# EasyEDA schematic pcb.json
TITLE: Sheet_1; REV: 1.0; Date: 2024-07-03; Sheet: 1/1; Drawn By: vaanika06; Company: Your Company
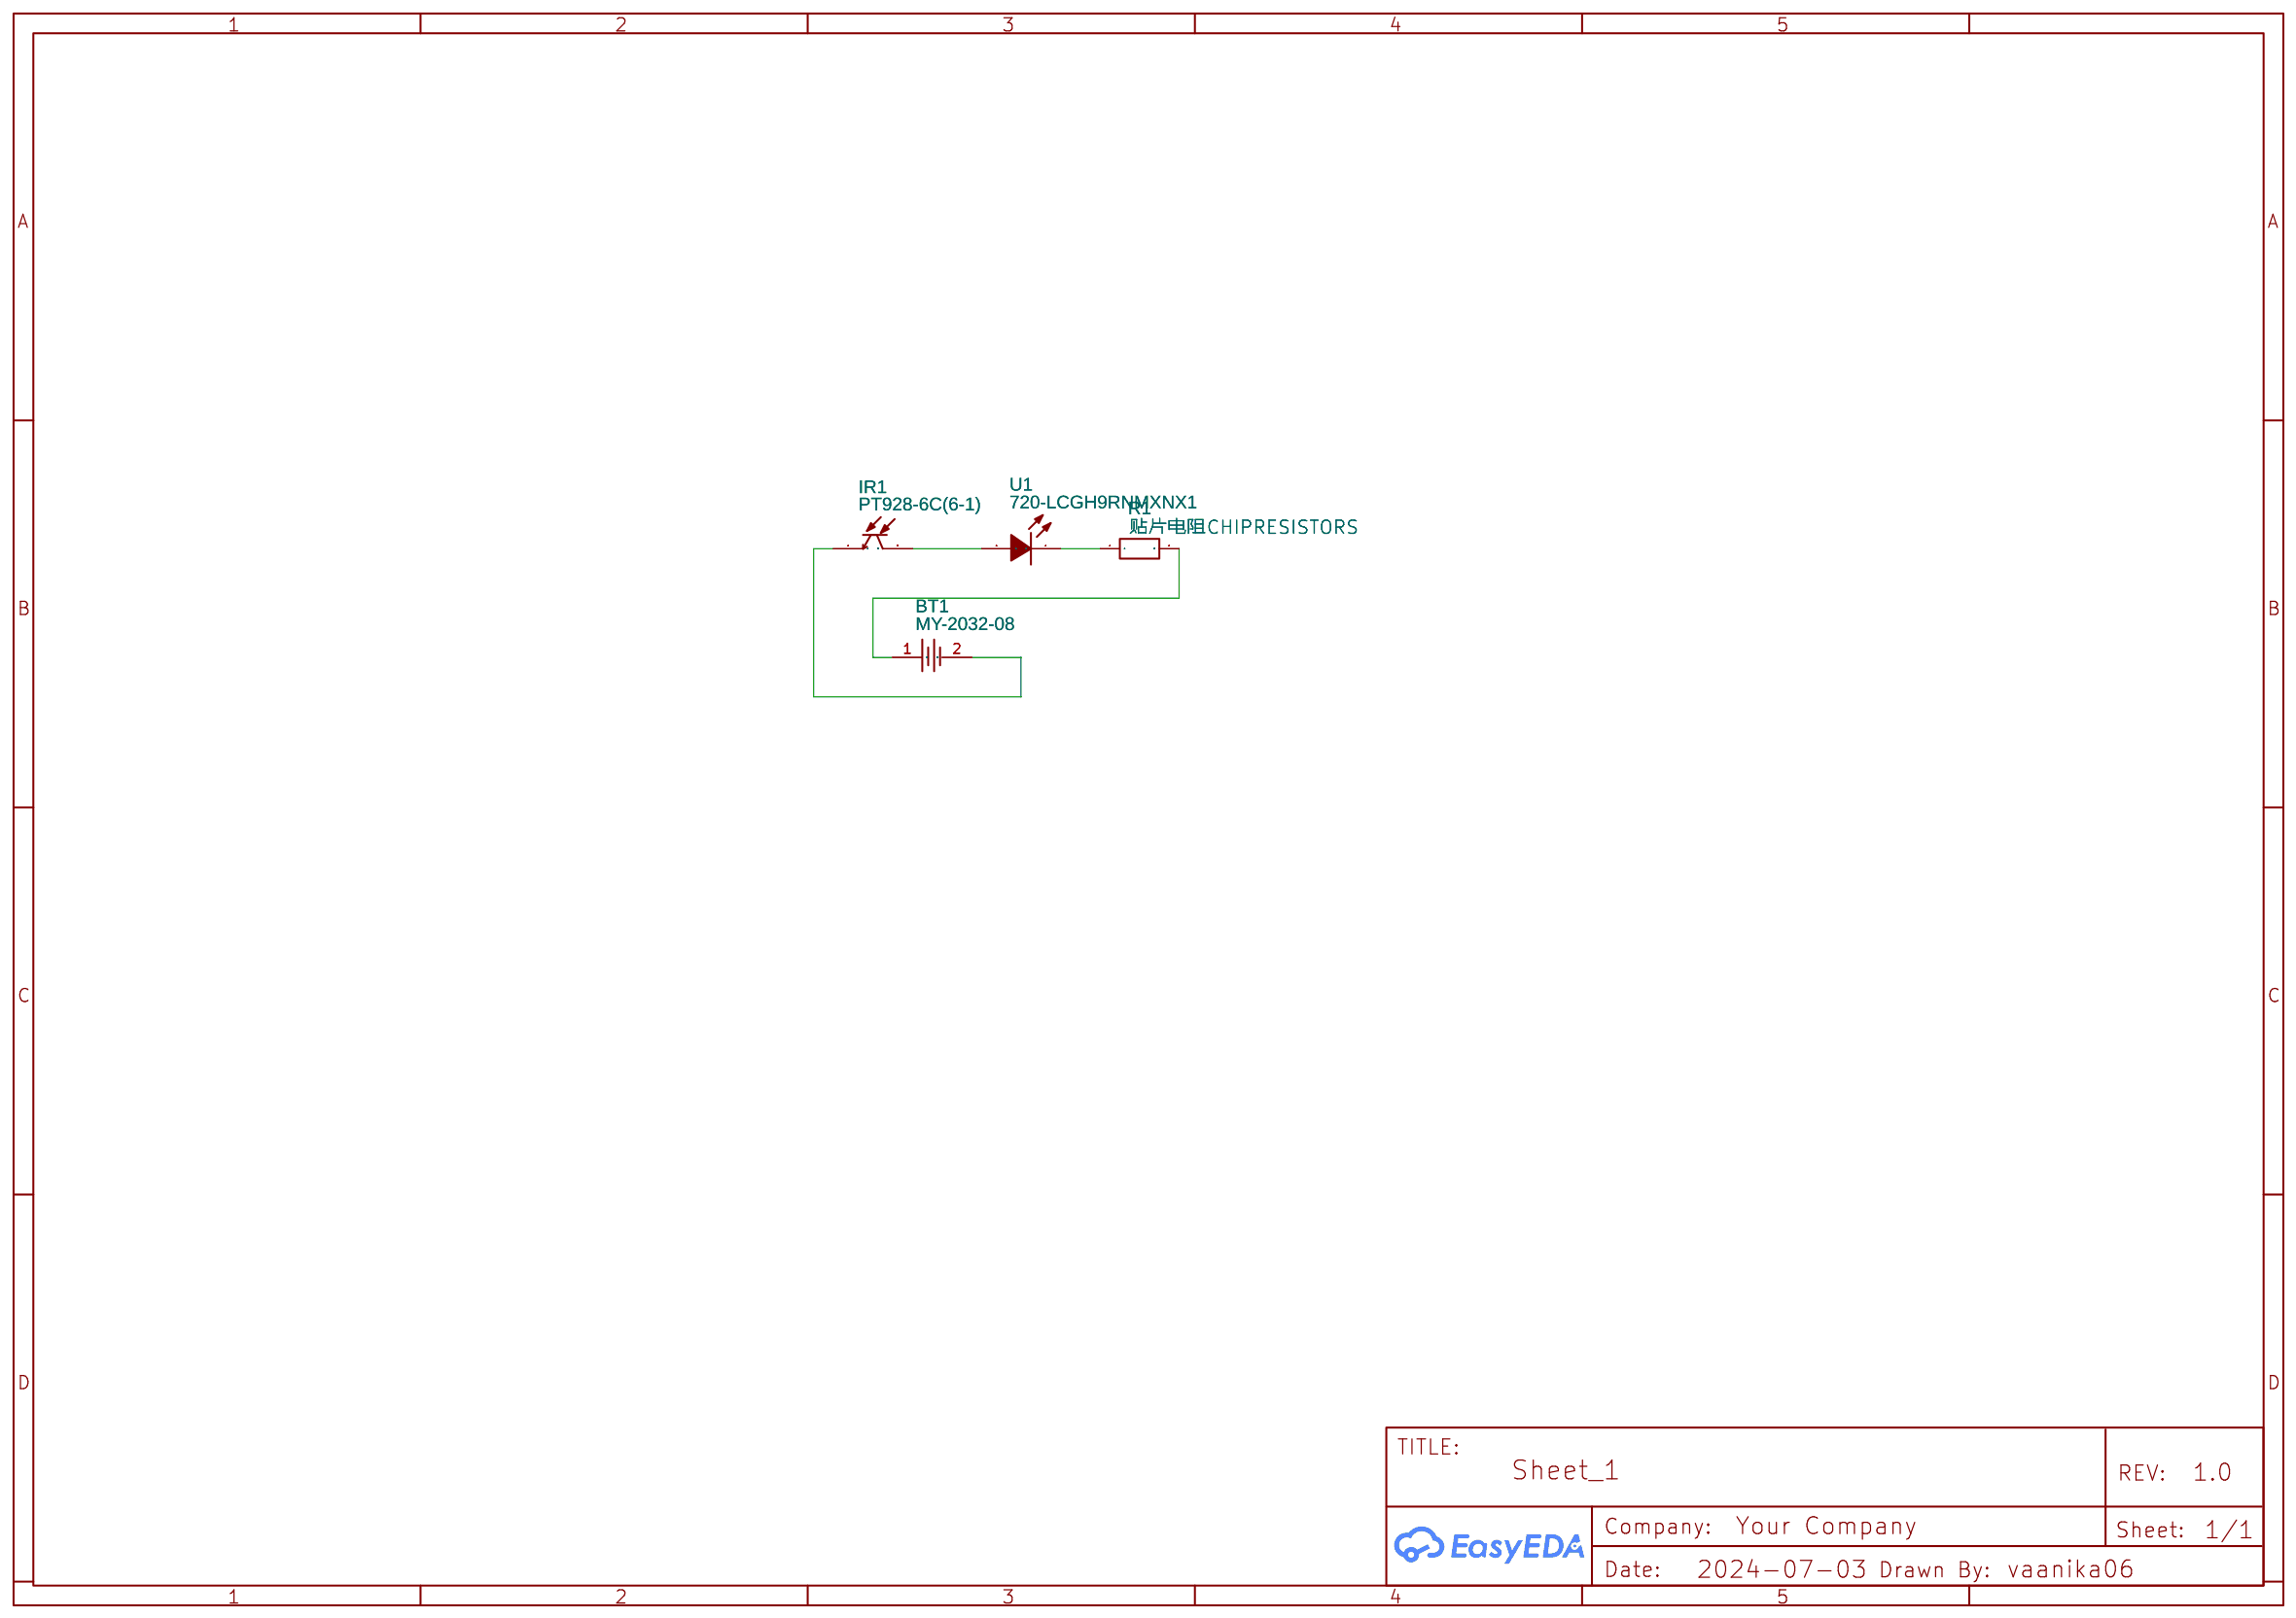
[diagram p0: schematic sheet]

## Parts
BT1  MY-2032-08  [BAT-SMD_MY-2032-08]
IR1  PT928-6C(6-1)  [LED-TH_L4.5-W1.5-P2.54-RD]
R1  贴片电阻CHIPRESISTORS  [R0603]
U1  720-LCGH9RNMXNX1  [LED-SMD_SD65-120-LED]

## Library data of the parts
BT1 = MY-2032-08: Contributor: LCSC; Supplier: LCSC; Supplier Part: C964831; Manufacturer: MYOUNG(美阳); JLCPCB Part Class: Extended Part
IR1 = PT928-6C(6-1): Supplier: LCSC; Manufacturer: EVERLIGHT(亿光); Supplier Part: C72049; JLCPCB Part Class: Extended Part
R1 = 贴片电阻CHIPRESISTORS: Contributor: lcsc; Supplier: LCSC; Supplier Part: C9900014833; Manufacturer: null; Manufacturer Part: 贴片电阻ChipResistors; JLCPCB Part Class: Extended Part
U1 = 720-LCGH9RNMXNX1: Contributor: lcsc; Supplier: LCSC; Supplier Part: C9900019959; Manufacturer: null; JLCPCB Part Class: Extended Part

## Nets
Net-(BT1-1): BT1.1 R1.2
Net-(BT1-2): BT1.2 IR1.1(E)
Net-(IR1-2): IR1.2(C) U1.2(A)
Net-(R1-1): R1.1 U1.1(K)
